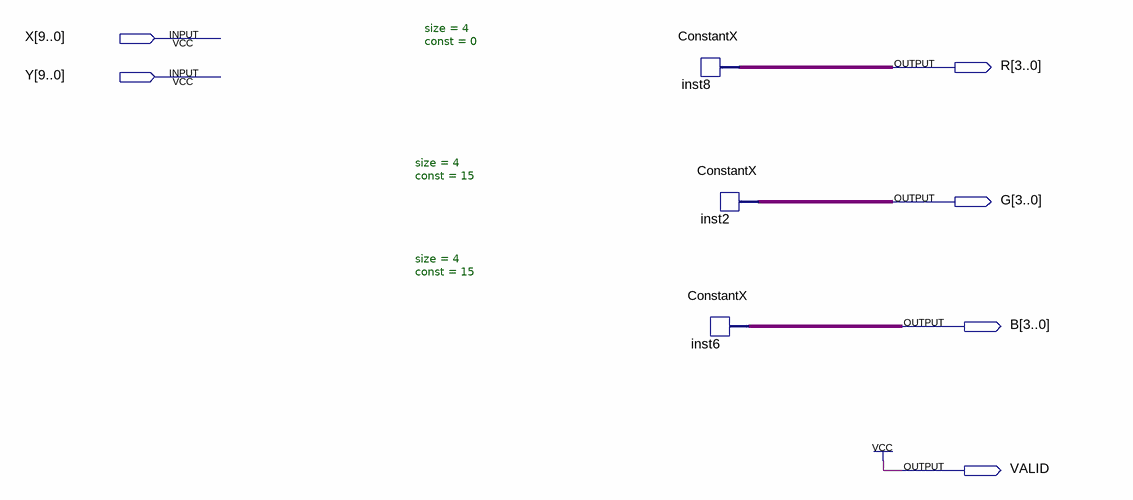
[diagram p0: schematic sheet]
// Quartus schematic BackgroundMain.bdf as structural Verilog: 3 symbols, 6 pins
module BackgroundMain (
  input  [9:0] X,
  input  [9:0] Y,
  output [3:0] R,
  output [3:0] G,
  output [3:0] B,
  output VALID
);

  ConstantX #(.size(4), .\const (0)) inst8 (.DATA_OUT(R));
  ConstantX #(.size(4), .\const (15)) inst2 (.DATA_OUT(G));
  ConstantX #(.size(4), .\const (15)) inst6 (.DATA_OUT(B));

  assign VALID = 1'b1;
endmodule
